# Altium schematic sheet STM32_Schematic.SchDoc
size A4; SheetNumber: 4; SheetTotal: 6
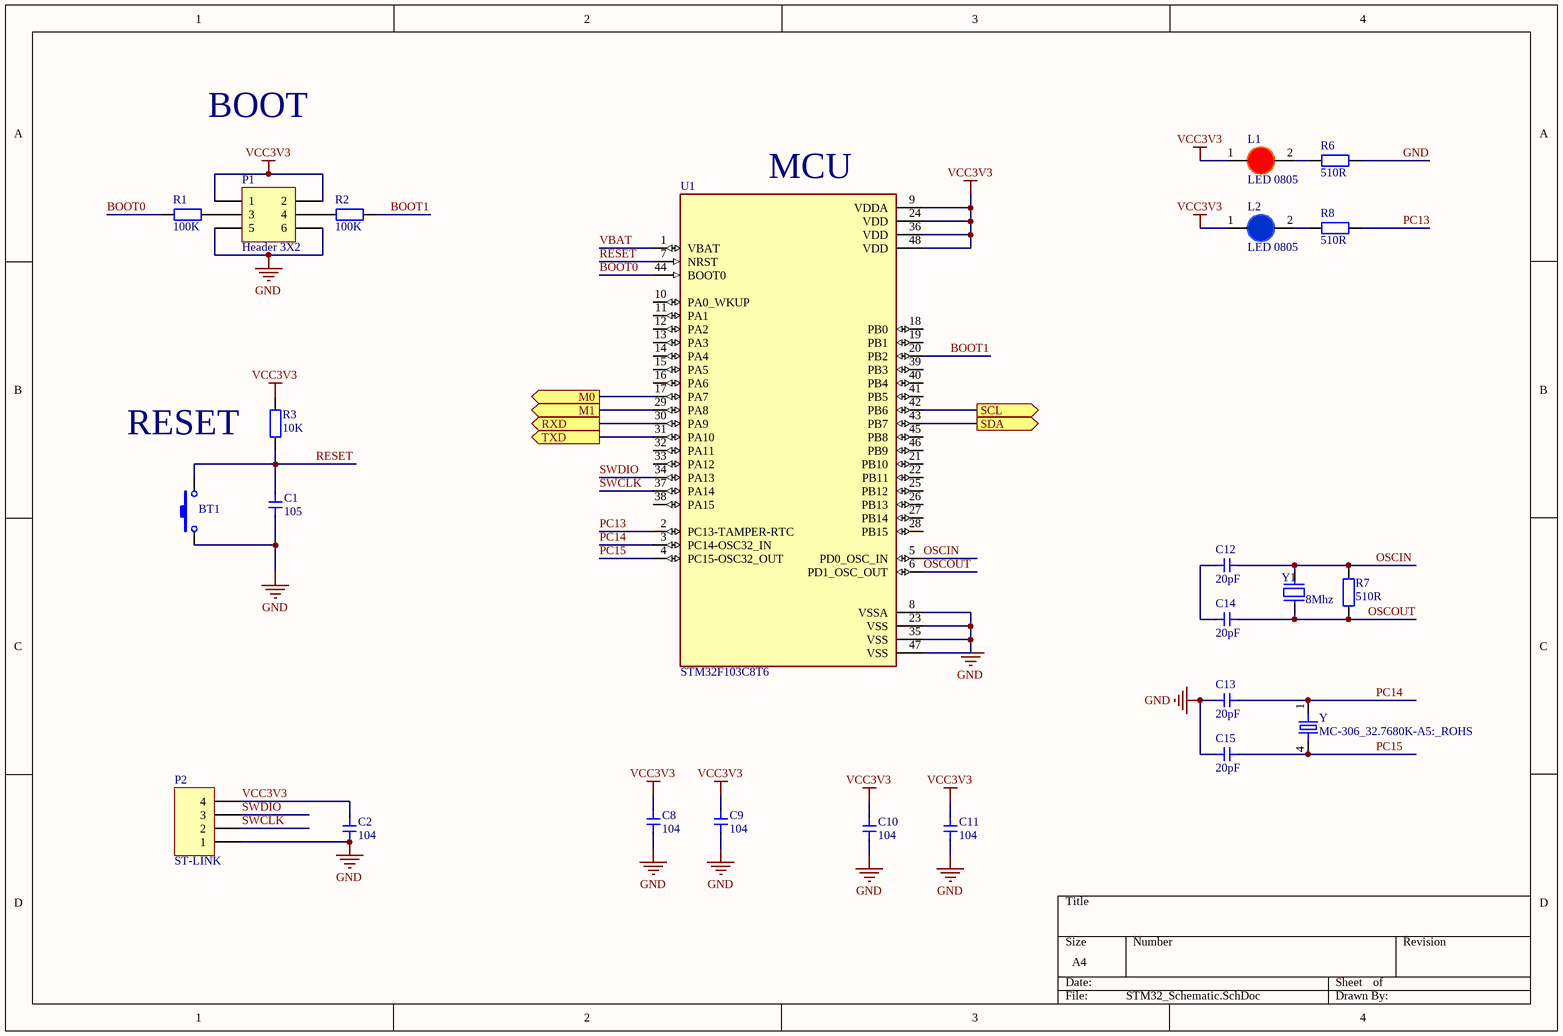
[diagram p0: STM32_Schematic.SchDoc]

## Parts
BT1  Nut Nhan 2 Chan SMD 3x6x2.5  [Nut Nhan 2 Chan SMD 3x6x2.5]  (value not drawn)
C1  105  [Cap 0805]
C2  104  [Cap 0805]
C8  104  [Cap 0805]
C9  104  [Cap 0805]
C10  104  [Cap 0805]
C11  104  [Cap 0805]
C12  20pF  [Cap 0805]
C13  20pF  [Cap 0805]
C14  20pF  [Cap 0805]
C15  20pF  [Cap 0805]
L1  LED 0805  [LED-0805-Red]
L2  LED 0805  [LED-0805-Blue]
P1  Header 3X2  [HDR2X3]
P2  ST-LINK  [HDR1X4]
R1  100K  [tro smd 0805]
R2  100K  [tro smd 0805]
R3  10K  [tro smd 0805]
R6  510R  [tro smd 0805]
R7  510R  [tro smd 0805]
R8  510R  [tro smd 0805]
U1  STM32F103C8T6  [QFP50P900X900X160-48N]
Y  MC-306_32.7680K-A5:_ROHS  [OSCL550P800X320X254-4N]
Y1  8Mhz  [Thach Anh 2 chan SMD5032]

## Ports
M0 (out), M1 (out), RXD (out), SCL (out), SDA (out), TXD (out)

## Nets
GND: BT1.1 C1.1 C2.1 C8.1 C9.1 C10.1 C11.1 C13.2 C15.2 P1.5 P1.6 P2.1 R6.2 U1.8(VSSA) U1.23(VSS) U1.35(VSS) U1.47(VSS)
VCC3V3: C2.2 C8.2 C9.2 C10.2 C11.2 L1.1(A) L2.1(A) P1.1 P1.2 P2.4 R3.2 U1.9(VDDA) U1.24(VDD) U1.36(VDD) U1.48(VDD)
BOOT0: R1.2 U1.44(BOOT0)
BOOT1: R2.1 U1.20(PB2)
M0: U1.17(PA7) ; port M0
M1: U1.29(PA8) ; port M1
OSCIN: C12.1 R7.2 U1.5(PD0_OSC_IN) Y1.1
OSCOUT: C14.1 R7.1 U1.6(PD1_OSC_OUT) Y1.2
PC13: R8.2 U1.2(PC13-TAMPER-RTC)
PC14: C13.1 U1.3(PC14-OSC32_IN) Y.1
PC15: C15.1 U1.4(PC15-OSC32_OUT) Y.4
RESET: BT1.2 C1.2 R3.1 U1.7(NRST)
RXD: U1.30(PA9) ; port RXD
SCL: U1.42(PB6) ; port SCL
SDA: U1.43(PB7) ; port SDA
SWCLK: P2.2 U1.37(PA14)
SWDIO: P2.3 U1.34(PA13)
TXD: U1.31(PA10) ; port TXD
VBAT: U1.1(VBAT)
NetC12_2: C12.2 C14.2
NetL1_2: L1.2(K) R6.1
NetL2_2: L2.2(K) R8.1
NetP1_3: P1.3 R1.1
NetP1_4: P1.4 R2.2

Not connected (* = marked no-connect by the designer): U1 10(PA0_WKUP) 11(PA1) 12(PA2) 13(PA3) 14(PA4) 15(PA5) 16(PA6) 18(PB0) 19(PB1) 21(PB10) 22(PB11) 25(PB12) 26(PB13) 27(PB14) 28(PB15) 32(PA11) 33(PA12) 38(PA15) 39(PB3) 40(PB4) 41(PB5) 45(PB8) 46(PB9)

## Notes on the sheet
- BOOT
- (near U1) MCU
- RESET

## Library data of the parts
BT1 = Nut Nhan 2 Chan SMD 3x6x2.5: Ma_Hang: MH001036; Ten: Nút Nhấn 2 Chân 3x6x2.5MM SMD
C1 C2 C8-C15 = Cap 0805: Capacitor SMD 0805
L1 = LED 0805 Do: Dán; Don_Vi: Con; Ma_Hang: MH000897; Ten_Linh_Kien: LED 0805 Màu Đỏ (Red); Ghi_Chu: *; Kieu_Chan: *; Chung_Loai: Dán
L2 = LED 0805 Xanh Duong: Dán; Don_Vi: Con; Ma_Hang: MH002327; Ten_Linh_Kien: LED 0805 Màu Xanh Dương (Blue); Ghi_Chu: *; Kieu_Chan: *; Chung_Loai: Dán
P1 = Header 3X2: Header, 3-Pin, Dual row; LatestRevisionDate: 17-Jul-2002; LatestRevisionNote: Re-released for DXP Platform.; Publisher: Altium Limited
P2 = Header 4: Header, 4-Pin; LatestRevisionDate: 17-Jul-2002; LatestRevisionNote: Re-released for DXP Platform.; Publisher: Altium Limited
R1-R3 R6-R8 = Tro 0805 1% 0.5R: Dán; Don_Vi: Con; So_Chan: 2; Ten_Linh_Kien: Trở 0805 1% 0.5R; Ma_Hang: MH005465; Chung_Loai: Dán; Kieu_Chan: *
U1 = STM32F103C8T6: ARM® Cortex®-M3 STM32F1 Microcontroller IC 32-Bit 72MHz 64KB (64K x 8) FLASH 48-LQFP (7x7); MF: STMicroelectronics; SnapEDA_Link: https://www.snapeda.com/parts/STM32F103C8T6/STMicroelectronics/view-part/?ref=snap; Package: LQFP-48 STMicroelectronics; Value: *; MP: STM32F103C8T6; Check_prices: https://www.snapeda.com/parts/STM32F103C8T6/STMicroelectronics/view-part/?ref=eda
Y = MC-306_32.7680K-A5:_ROHS: 32.768kHz Â±100ppm Crystal 12.5pF 50 kOhms 4-SOJ, 5.50mm pitch; MP: MC-306 32.7680K-A5: ROHS; MF: EPSON; Price: None; Availability: Unavailable; Package: 4-4 Epson; SnapEDA_Link: https://www.snapeda.com/parts/MC-306%2032.7680K-A5%3A%20ROHS/EPSON/view-part/620500/?ref=snap; Value: *
Y1 = Thach Anh 2 chan SMD 5032: Crystal For all Crystal 2pin.; Value: 4Mhz